# Altium schematic sheet SoundRateGenerator.SCHDOC
size A; Organization: Altium Limited; Address1: L3, 12a Rodborough Rd; Address2: Frenchs Forest; Address3: NSW; Address4: Australia 2086; DocumentNumber: 5; SheetNumber: 5; SheetTotal: 6
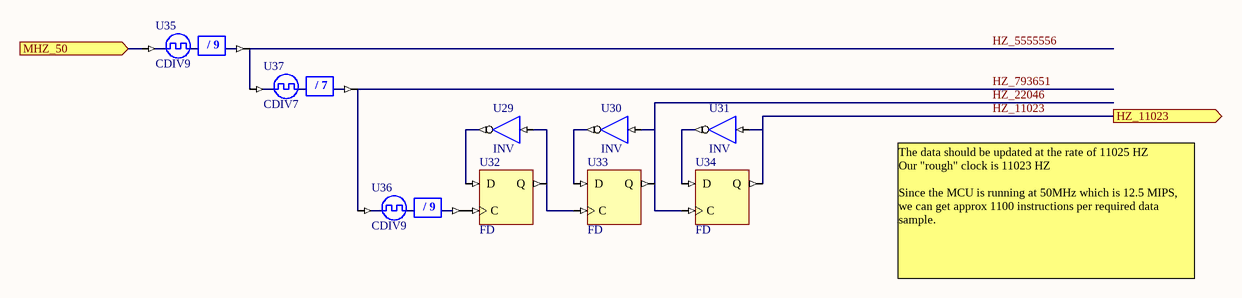
[diagram p0: SoundRateGenerator.SCHDOC]

## Parts
U29  INV
U30  INV
U31  INV
U32  FD
U33  FD
U34  FD
U35  CDIV9
U36  CDIV9
U37  CDIV7

## Ports
HZ_11023 (out), MHZ_50 (in)

## Nets
HZ_11023: U31.I U34.Q ; port HZ_11023
HZ_22046: U30.I U33.Q U34.C
HZ_793651: U36.CLKIN U37.CLKDV
HZ_5555556: U35.CLKDV U37.CLKIN
MHZ_50: U35.CLKIN ; port MHZ_50
NetU29_I: U29.I U32.Q U33.C
NetU29_O: U29.O U32.D
NetU30_O: U30.O U33.D
NetU31_O: U31.O U34.D
NetU32_C: U32.C U36.CLKDV

## Notes on the sheet
- The data should be updated at the rate of 11025 HZ
  Our "rough" clock is 11023 HZ
  Since the MCU is running at 50MHz which is 12.5 MIPS, we can get approx 1100 instructions per required data sample.
- Title
- Size:
- Date:
- A
- Number:
- Time:
- Revision:
- Sheet
- of
- File:
- (in symbol CDIV7) / 7
- (in symbol CDIV9) / 9

## Library data of the parts
U29-U31 = INV: Inverter; ArchiveName: GENERIC; Published: 18-Nov-2003; Publisher: Altium Limited; Xilinx Equivalent: INV; Core Revision: 1.00.00
U32-U34 = FD: D-Type Flip-Flop; ArchiveName: GENERIC; Published: 18-Nov-2003; Publisher: Altium Limited; Xilinx Equivalent: FD; Core Revision: 1.00.00
U35 U36 = CDIV9: Clock Divider by 9; ArchiveName: GENERIC; Published: 18-Nov-2003; Publisher: Altium Limited; Core Revision: 1.00.00
U37 = CDIV7: Clock Divider by 7; ArchiveName: GENERIC; Published: 18-Nov-2003; Publisher: Altium Limited; Core Revision: 1.00.00